# EAGLE schematic Dist Monitoring Sensors for Thesis (EAGLE 9.1.3)
CNAME: ALICAD; CREVISION: 2.0; DESIGNER: Alan Ibbett
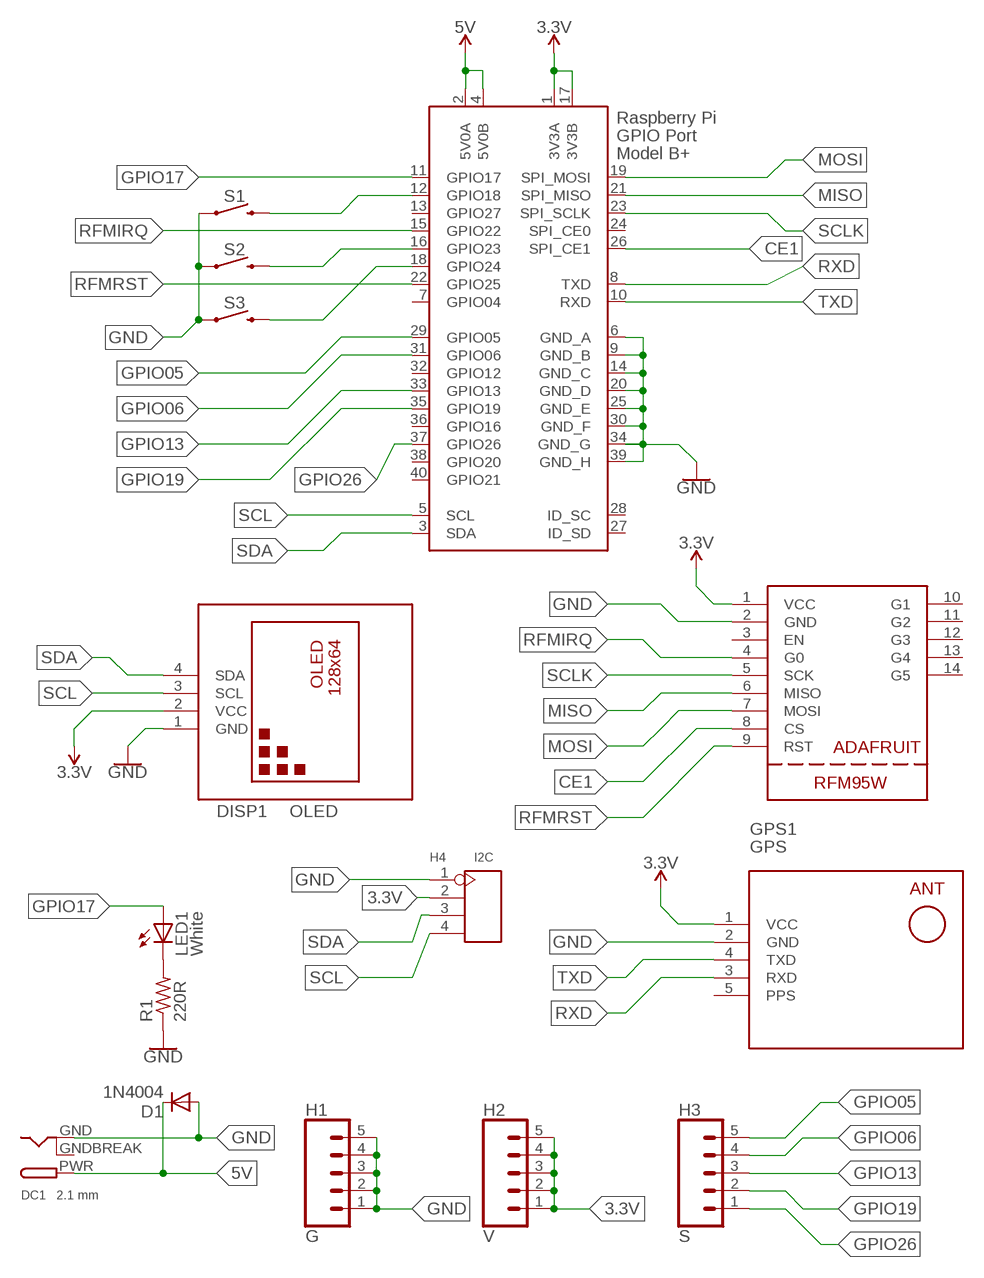
[diagram p0: schematic, sheet 1]

## Parts
D1  1N4004  [DO41-10]
DC1  2.1 mm  DCBARRELPTH  [DCJACK_2MM_PTH]
DISP1  OLED  DISPLAY-OLED-128X64-I2C  [DISPLAY-OLED-128X64-I2C]
GPS1  GPS  GPS-RECEIVER-NEO6MGENERIC  [GPS-RECEIVER-NEO6M-GENERIC]
H1  G  CONN_05  [1X05]
H2  V  CONN_05  [1X05]
H3  S  CONN_05  [1X05]
H4  I2C  DIP-BLACK-MALE-HEADER-VERT(4P-2.54)  [H4-2.54]
LED1  White  LED3MM  [LED3MM]
R1  220R  R-US_0207/10  [0207/10]
S1  MOMENTARY-SWITCH-SPST-PTH-6.0MM  [TACTILE_SWITCH_PTH_6.0MM]
S2  MOMENTARY-SWITCH-SPST-PTH-6.0MM  [TACTILE_SWITCH_PTH_6.0MM]
S3  MOMENTARY-SWITCH-SPST-PTH-6.0MM  [TACTILE_SWITCH_PTH_6.0MM]
U1  RFM95W  [RFM95W]
X1  Raspi 40 Pin Connector  RASPI_BOARD_B+#_E3P  [RASPI_BOARD_B+_EDGES_3DRILL_PAD]

## Nets
3.3V: DISP1.2(VCC) GPS1.1(VCC) H2.1 H2.2 H2.3 H2.4 H2.5 H4.2 U1.1(VCC) X1.1(3V3A) X1.17(3V3B)
5V: D1.C DC1.PWR X1.2(5V0A) X1.4(5V0B)
CE1: U1.8(CS) X1.26(SPI_CE1)
GND: D1.A DC1.GND DISP1.1(GND) GPS1.2(GND) H1.1 H1.2 H1.3 H1.4 H1.5 H4.1 R1.1 S1.1 S2.1 S3.1 U1.2(GND) X1.6(GND_A) X1.9(GND_B) X1.14(GND_C) X1.20(GND_D) X1.25(GND_E) X1.30(GND_F) X1.34(GND_G) X1.39(GND_H)
GPIO05: H3.5 X1.29(GPIO05)
GPIO06: H3.4 X1.31(GPIO06)
GPIO13: H3.3 X1.33(GPIO13)
GPIO17: LED1.A X1.11(GPIO17)
GPIO18: S1.3 X1.12(GPIO18)
GPIO19: H3.2 X1.35(GPIO19)
GPIO23: S2.3 X1.16(GPIO23)
GPIO24: S3.3 X1.18(GPIO24)
GPIO26: H3.1 X1.37(GPIO26)
MISO: U1.6(MISO) X1.21(SPI_MISO)
MOSI: U1.7(MOSI) X1.19(SPI_MOSI)
N$1: LED1.K(C) R1.2
RFMIRQ: U1.4(G0) X1.15(GPIO22)
RFMRST: U1.9(RST) X1.22(GPIO25)
RXD: GPS1.3(RXD) X1.8(TXD)
SCL: DISP1.3(SCL) H4.4 X1.5(SCL)
SCLK: U1.5(SCK) X1.23(SPI_SCLK)
SDA: DISP1.4(SDA) H4.3 X1.3(SDA)
TXD: GPS1.4(TXD) X1.10(RXD)
Unconnected: GPS1.5(PPS) U1.3(EN) U1.10(G1) U1.11(G2) U1.12(G3) U1.13(G4) U1.14(G5) X1.7(GPIO04) X1.13(GPIO27) X1.24(SPI_CE0) X1.27(ID_SD) X1.28(ID_SC) X1.32(GPIO12) X1.36(GPIO16) X1.38(GPIO20) X1.40(GPIO21)

## Power pins joined to a net without a drawn wire
GNDBREAK: DC1.GNDBREAK

## Library data of the parts
D1 = adafruit:1N4004: DIODE General purpose 1N400x type rectifier (With bigger pads) http://www.ladyada.net/library/pcb/eaglelibrary.html
DC1 = adafruit:DCBARREL: 2.0mm DC Barrel Jack DCJACK_2MM_PTH - Through Hole Jack (4UConnector: 05537)
DISP1 = Alicad:DISPLAY-OLED-128X64-I2C: 128x64 Dot Matrix OLED Module based on SSD1306 chip Variant with I2C interface More details available here: http://www.instructables.com/id/Monochrome-096-i2c-OLED-display-with-arduino-SSD13/ SSD1306 datasheet: https://cdn-shop.adafruit.com/datasheets/SSD1306.pdf Click here to find device on ebay.com <http://www.ebay.com/sch/oled+display+128x64+iic> Note: There are two variants: I2C and SPI. Search for the proper version.
GPS1 = Alicad:GPS-RECEIVER-NEO6M: Generic GPS Receiver Module based on NEO-6 device This is based on the Generic UBLOX Chinese modules.
H1-H3 = SparkFun-Connectors:CONN_05: Multi connection point. Often used as Generic Header-pin footprint for 0.1 inch spaced/style header connections On any of the 0.1 inch spaced packages, you can populate with these: Break Away Headers - Straight <https://www.sparkfun.com/products/116> (PRT-00116) Break Away Male Headers - Right Angle <https://www.sparkfun.com/products/553> (PRT-00553) Female Headers <https://www.sparkfun.com/products/115> (PRT-00115) Break Away Headers - Machine Pin <https://www.sparkfun.com/products/117> (PRT-00117) Break Away Female Headers - Swiss Machine Pin <https://www.sparkfun.com/products/743> (PRT-00743) For SCREWTERMINALS and SPRING TERMINALS visit here: Screw Terimnals on SparkFun.com <https://www.sparkfun.com/search/results?term=Screw+Terminals> (5mm/3.5mm/2.54mm spacing) This device is also useful as a general connection point to wire up your design to another part of your project. Our various solder wires solder well into these plated through hole pads. Hook-Up Wire - Assortment (Stranded, 22 AWG) <https://www.sparkfun.com/products/11375> (PRT-11375) Hook-Up Wire - Assortment (Solid Core, 22 AWG) <https://www.sparkfun.com/products/11367> (PRT-11367) View the entire wire category on our website here <https://www.sparkfun.com/categories/141> Special notes: Molex polarized connector foot print use with SKU : PRT-08231 with associated crimp pins and housings. 1MM SMD Version SKU: PRT-10208
H4 = Seeed-Connector:DIP-BLACK-MALE-HEADER-VERT(4P-2.54): 320020017; MPN: P125-1104A0BS116A1; VALUE: 4p-2.54
LED1 = adafruit:LED: LED OSRAM: - CHIPLED LG R971, LG N971, LY N971, LG Q971, LY Q971, LO R971, LY R971 LH N974, LH R974 LS Q976, LO Q976, LY Q976 LO Q996 - Hyper CHIPLED LW Q18S LB Q993, LB Q99A, LB R99A - SideLED LS A670, LO A670, LY A670, LG A670, LP A670 LB A673, LV A673, LT A673, LW A673 LH A674 LY A675 LS A676, LA A676, LO A676, LY A676, LW A676 LS A679, LY A679, LG A679 - Hyper Micro SIDELED® LS Y876, LA Y876, LO Y876, LY Y876 LT Y87S - SmartLED LW L88C, LW L88S LB L89C, LB L89S, LG L890 LS L89K, LO L89K, LY L89K LS L896, LA L896, LO L896, LY L896 - TOPLED LS T670, LO T670, LY T670, LG T670, LP T670 LSG T670, LSP T670, LSY T670, LOP T670, LYG T670 LG T671, LOG T671, LSG T671 LB T673, LV T673, LT T673, LW T673 LH T674 LS T676, LA T676, LO T676, LY T676, LB T676, LH T676, LSB T676, LW T676 LB T67C, LV T67C, LT T67C, LS T67K, LO T67K, LY T67K, LW E67C LS E67B, LA E67B, LO E67B, LY E67B, LB E67C, LV E67C, LT E67C LW T67C LS T679, LY T679, LG T679 LS T770, LO T770, LY T770, LG T770, LP T770 LB T773, LV T773, LT T773, LW T773 LH T774 LS E675, LA E675, LY E675, LS T675 LS T776, LA T776, LO T776, LY T776, LB T776 LHGB T686 LT T68C, LB T68C - Hyper Mini TOPLED® LB M676 - Mini TOPLED Santana® LG M470 LS M47K, LO M47K, LY M47K Source: http://www.osram.convergy.de/
R1 = adafruit:R-US_: RESISTOR, American symbol
S1-S3 = SparkFun-Switches:MOMENTARY-SWITCH-SPST: Momentary Switch (Pushbutton) - SPST Normally-open (NO) SPST momentary switches (buttons, pushbuttons). Variants PTH-12MM - 12mm square, through-hole Momentary Pushbutton Switch - 12mm Square <https://www.sparkfun.com/products/9190> (COM-09190) PTH-6.0MM, PTH-6.0MM-KIT - 6.0mm square, through-hole Mini Pushbutton Switch <https://www.sparkfun.com/products/97> (COM-00097) KIT package intended for soldering kit's - only one side of pads' copper is exposed. PTH-RIGHT-ANGLE-KIT - Right-angle, through-hole Right Angle Tactile Button <https://www.sparkfun.com/products/10791> - Used on SparkFun BigTime Watch Kit <https://www.sparkfun.com/products/11734> SMD-12MM - 12mm square, surface-mount Tactile Button - SMD (12mm) <https://www.sparkfun.com/products/12993> (COM-12993) Used on SparkFun PicoBoard <https://www.sparkfun.com/products/11888> SMD-4.5MM - 4.5mm Square Trackball Switch Used on SparkFun Blackberry Trackballer Breakout <https://www.sparkfun.com/products/13169> SMD-4.6MMX2.8MM - 4.60mm x 2.80mm, surface mount Used on SparkFun SAMD21 Mini Breakout <https://www.sparkfun.com/products/13664> SMD-5.2MM, SMD-5.2-REDUNDANT - 5.2mm square, surface-mount Mini Pushbutton Switch - SMD <https://www.sparkfun.com/products/8720> (COM-08720) Used on Arduino Pro Mini <https://www.sparkfun.com/products/11114> REDUNDANT package connects both switch circuits together SMD-6.0X3.5MM - 6.0 x 3.5mm, surface mount Momentary Reset Switch SMD <https://www.sparkfun.com/products/8229> (COM-08229) SMD-6.2MM-TALL - 6.2mm square, surface mount Tactile Button - SMD (6mm) <https://www.sparkfun.com/products/12992> Used on SparkFun Digital Sandbox <https://www.sparkfun.com/products/12651> SMD-RIGHT-ANGLE - Right-angle, surface mount Used on SparkFun Block for Intel® Edison - Arduino <https://www.sparkfun.com/products/13036>; PROD_ID: SWCH-08441; SF_SKU: COM-00097
U1 = Alicad:RFM95W: Adafruit LORA Packet Radio
X1 = raspberrypi_bastelstube_v13:RASPI_BOARD_B+#: Raspberry Pi GPIO connector with markings for the outer dimensions of the Raspberry Pi board model B+ with different sets of drill holes or mounting pads All pins connected